# Altium schematic sheet barometer_temp_humidity.SchDoc
size Letter
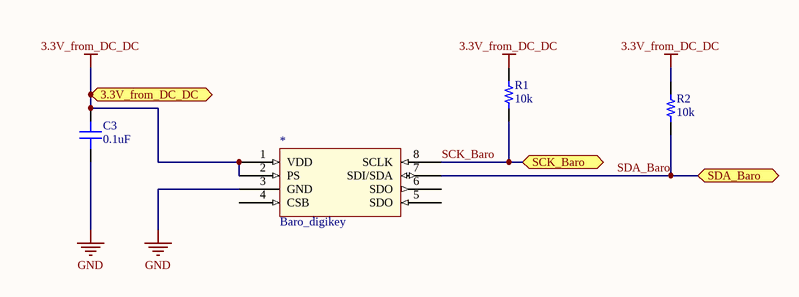
[diagram p0: barometer_temp_humidity.SchDoc]

## Parts
*  Baro_digikey  [MS5607-02BA03]
C3  0.1uF  [CAP 0402/1005]
R1  10k  [RES 0603/1608]
R2  10k  [RES 0603/1608]

## Ports
3.3V_from_DC_DC, SCK_Baro, SDA_Baro

## Nets
3.3V_from_DC_DC: *.1(VDD) *.2(PS) C3.2 R1.2 R2.2 ; port 3.3V_from_DC_DC
GND: *.3(GND) C3.1
SCK_Baro: *.8(SCLK) R1.1 ; port SCK_Baro
SDA_Baro: *.7(SDI/SDA) R2.1 ; port SDA_Baro

Not connected (* = marked no-connect by the designer): * 4(CSB) 5(SDO) 6(SDO)

## Library data of the parts
* = Baro_digikey: 223-1198-1-ND baro
C3 = C1005X7R1C104K050BC: CAP CER 0.1UF 16V X7R 0402; Manufacturer: TDK Corporation; TemperatureRange: -55C ~ 125C; Tolerance: 10%; Value: 0.1uF; Part Number: C1005X7R1C104K050BC; PartId: 3856; Supplier 1: Digi-Key; Supplier Part Number 1: 445-4952-2-ND; ComponentLink1Description: Datasheet; ComponentLink1URL: https://product.tdk.com/info/en/catalog/datasheets/mlcc_commercial_general_en.pdf; ComponentLink2Description: Digi-Key listing; ComponentLink2URL: http://digikey.com/product-detail/en/C1005X7R1C104K050BC/445-4952-2-ND/2093220; TemperatureCoefficient: X7R; Voltage: 16V; Price: 0.0066; Type: -; Device Package: 0402 (1005 Metric)
R1 R2 = ERJ-3EKF1001V: RES SMD 1K OHM 1% 1/10W 0603; Manufacturer: Panasonic Electronic Components; TemperatureRange: -55C ~ 155C; TemperatureCoefficient: 100ppm/C; PowerRating: 0.1W, 1/10W; Value: 10k; Part Number: ERJ-3EKF1001V; PartId: 885; Supplier 1: Digi-Key; Supplier Part Number 1: P1.00KHTR-ND; ComponentLink1Description: Datasheet; ComponentLink1URL: http://industrial.panasonic.com/www-cgi/jvcr13pz.cgi?E+PZ+3+AOA0002+ERJ3EKF1001V+7+WW; ComponentLink2Description: Digi-Key listing; ComponentLink2URL: http://digikey.com/product-detail/en/ERJ-3EKF1001V/P1.00KHTR-ND/196032; Tolerance: 1%; Price: 0.0038; Type: Thick Film; Device Package: 0603 (1608 Metric)